# Altium schematic sheet Sheet1.SchDoc
size B; SheetNumber: 1; SheetTotal: 1
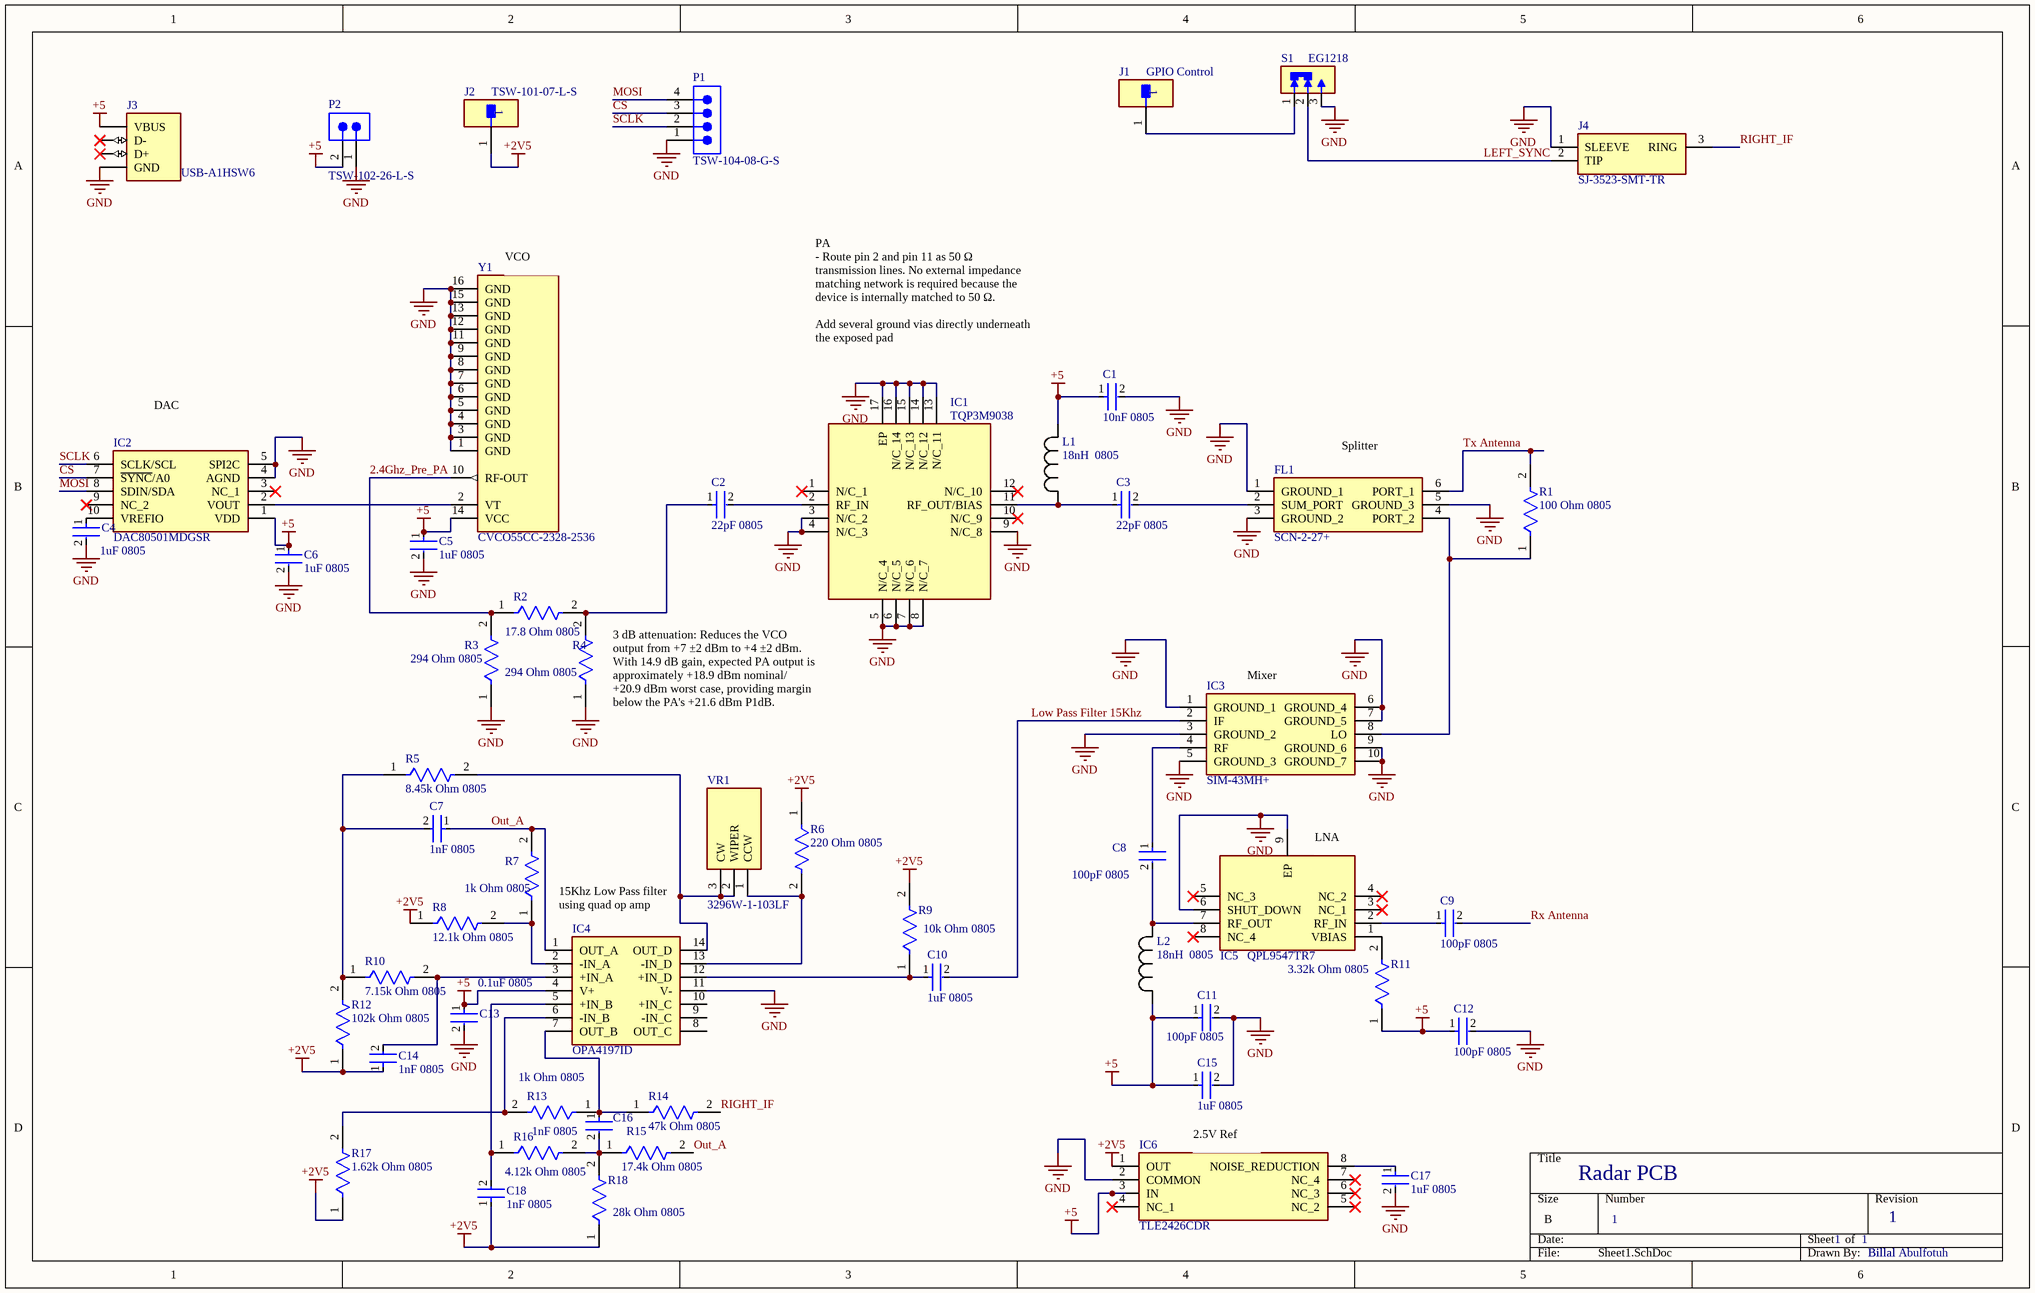
[diagram p0: Sheet1.SchDoc]

## Parts
C1  10nF 0805  [FP-C0805C103K8RACAUTO-MFG]
C2  22pF 0805  [FP-C0805C103K8RACAUTO-MFG]
C3  22pF 0805  [FP-C0805C103K8RACAUTO-MFG]
C4  1uF 0805  [FP-C0805C103K8RACAUTO-MFG]
C5  1uF 0805  [FP-C0805C103K8RACAUTO-MFG]
C6  1uF 0805  [FP-C0805C103K8RACAUTO-MFG]
C7  1nF 0805  [FP-C0805C103K8RACAUTO-MFG]
C8  100pF 0805  [FP-C0805C103K8RACAUTO-MFG]
C9  100pF 0805  [FP-C0805C103K8RACAUTO-MFG]
C10  1uF 0805  [FP-C0805C103K8RACAUTO-MFG]
C11  100pF 0805  [FP-C0805C103K8RACAUTO-MFG]
C12  100pF 0805  [FP-C0805C103K8RACAUTO-MFG]
C13  0.1uF 0805  [FP-C0805C103K8RACAUTO-MFG]
C14  1nF 0805  [FP-C0805C103K8RACAUTO-MFG]
C15  1uF 0805  [FP-C0805C103K8RACAUTO-MFG]
C16  1nF 0805  [FP-C0805C103K8RACAUTO-MFG]
C17  1uF 0805  [FP-C0805C103K8RACAUTO-MFG]
C18  1nF 0805  [FP-C0805C103K8RACAUTO-MFG]
FL1  SCN-2-27+  [SCN227]
IC1  TQP3M9038  [QFN50P300X300X90-17N-D]
IC2  DAC80501MDGSR  [SOP50P490X110-10N]
IC3  SIM-43MH+  [SIM43MH]
IC4  OPA4197ID  [SOIC127P600X175-14N]
IC5  QPL9547TR7  [SON50P200X200X95-9N-D]
IC6  TLE2426CDR  [SOIC127P600X175-8N]
J1  GPIO Control  [FP-TSW-101-07-L-S-MFG]
J2  TSW-101-07-L-S  [FP-TSW-101-07-L-S-MFG]
J3  USB-A1HSW6  [OST_USB-A1HSW6]
J4  SJ-3523-SMT-TR  [SJ3523SMTTR]
L1  18nH  0805  [IND_BOURNS_CW201212]
L2  18nH  0805  [IND_BOURNS_CW201212]
P1  TSW-104-08-G-S  [SMTC-TSW-104-08-X-S]
P2  TSW-102-26-L-S  [SMTC-TSW-102-26-XX-S]
R1  100 Ohm 0805  [FP-RT0805-MFG]
R2  17.8 Ohm 0805  [FP-RT0805-MFG]
R3  294 Ohm 0805  [FP-RT0805-MFG]
R4  294 Ohm 0805  [FP-RT0805-MFG]
R5  8.45k Ohm 0805  [FP-RT0805-MFG]
R6  220 Ohm 0805  [FP-RT0805-MFG]
R7  1k Ohm 0805  [FP-RT0805-MFG]
R8  12.1k Ohm 0805  [FP-RT0805-MFG]
R9  10k Ohm 0805  [FP-RT0805-MFG]
R10  7.15k Ohm 0805  [FP-RT0805-MFG]
R11  3.32k Ohm 0805  [FP-RT0805-MFG]
R12  102k Ohm 0805  [FP-RT0805-MFG]
R13  1k Ohm 0805  [FP-RT0805-MFG]
R14  47k Ohm 0805  [FP-RT0805-MFG]
R15  17.4k Ohm 0805  [FP-RT0805-MFG]
R16  4.12k Ohm 0805  [FP-RT0805-MFG]
R17  1.62k Ohm 0805  [FP-RT0805-MFG]
R18  28k Ohm 0805  [FP-RT0805-MFG]
S1  EG1218  [SW_EG1218]
VR1  3296W-1-103LF  [3296W1503LF]
Y1  CVCO55CC-2328-2536  [XTAL_CVCO55CC-2400-2400]

## Nets
+2V5: C14.1 C18.1 IC6.1(OUT) J2.1 R6.1 R8.1 R9.2 R12.1 R17.1 R18.1
+5: C1.1 C5.1 C6.1 C11.1 C12.1 C13.1 C15.1 IC2.1(VDD) IC4.4(V+) IC6.3(IN) J3.1(VBUS) L1.1 L2.2 P2.2 R11.1 Y1.14(VCC)
GND: C1.2 C4.2 C5.2 C6.2 C11.2 C12.2 C13.2 C15.2 C17.2 FL1.1(GROUND_1) FL1.3(GROUND_2) FL1.5(GROUND_3) IC1.3(N/C_2) IC1.4(N/C_3) IC1.5(N/C_4) IC1.6(N/C_5) IC1.7(N/C_6) IC1.8(N/C_7) IC1.9(N/C_8) IC1.13(N/C_11) IC1.14(N/C_12) IC1.15(N/C_13) IC1.16(N/C_14) IC1.17(EP) IC2.4(AGND) IC2.5(SPI2C) IC3.1(GROUND_1) IC3.3(GROUND_2) IC3.5(GROUND_3) IC3.6(GROUND_4) IC3.7(GROUND_5) IC3.9(GROUND_6) IC3.10(GROUND_7) IC4.11(V-) IC5.6(SHUT_DOWN) IC5.9(EP) IC6.2(COMMON) J3.4(GND) J4.1(SLEEVE) P1.1 P2.1 R3.1 R4.1 S1.3(NO) Y1.1(GND) Y1.3(GND) Y1.4(GND) Y1.5(GND) Y1.6(GND) Y1.7(GND) Y1.8(GND) Y1.9(GND) Y1.11(GND) Y1.12(GND) Y1.13(GND) Y1.15(GND) Y1.16(GND)
2.4Ghz_Pre_PA: R2.1 R3.2 Y1.10(RF-OUT)
CS: IC2.7(~{SYNC}/A0) P1.3
LEFT_SYNC: J4.2(TIP) S1.2(COM)
Low Pass Filter 15Khz: C10.2 IC3.2(IF)
MOSI: IC2.8(SDIN/SDA) P1.4
Out_A: C7.1 IC4.1(OUT_A) R7.2 R15.2
RIGHT_IF: J4.3(RING) R14.2
Rx Antenna: C9.2
SCLK: IC2.6(SCLK/SCL) P1.2
Tx Antenna: FL1.6(PORT_1) R1.2
NetC2_1: C2.1 R2.2 R4.2
NetC2_2: C2.2 IC1.2(RF_IN)
NetC3_1: C3.1 IC1.11(RF_OUT/BIAS) L1.2
NetC3_2: C3.2 FL1.2(SUM_PORT)
NetC4_1: C4.1 IC2.10(VREFIO)
NetC7_2: C7.2 R5.1 R10.1 R12.2
NetC8_1: C8.1 IC3.4(RF)
NetC8_2: C8.2 IC5.7(RF_OUT) L2.1
NetC9_1: C9.1 IC5.2(RF_IN)
NetC10_1: C10.1 IC4.12(+IN_D) R9.1
NetC14_2: C14.2 IC4.3(+IN_A) R10.2
NetC16_1: C16.1 IC4.7(OUT_B) R13.1 R14.1
NetC16_2: C16.2 R15.1 R16.2 R18.2
NetC17_1: C17.1 IC6.8(NOISE_REDUCTION)
NetC18_2: C18.2 IC4.5(+IN_B) R16.1
NetFL1_4: FL1.4(PORT_2) IC3.8(LO) R1.1
NetIC2_2: IC2.2(VOUT) Y1.2(VT)
NetIC4_2: IC4.2(-IN_A) R7.1 R8.2
NetIC4_6: IC4.6(-IN_B) R13.2 R17.2
NetIC4_13: IC4.13(-IN_D) R6.2 VR1.1(CCW)
NetIC4_14: IC4.14(OUT_D) R5.2 VR1.2(WIPER) VR1.3(CW)
NetIC5_1: IC5.1(VBIAS) R11.2
NetJ1_1: J1.1 S1.1(NC)

Not connected (* = marked no-connect by the designer): IC1 1(N/C_1)* 10(N/C_9)* 12(N/C_10)*; IC2 3(NC_1)* 9(NC_2)*; IC4 8(OUT_C) 9(-IN_C) 10(+IN_C); IC5 3(NC_1)* 4(NC_2)* 5(NC_3)* 8(NC_4)*; IC6 4(NC_1)* 5(NC_2)* 6(NC_3)* 7(NC_4)*; J3 2(D-)* 3(D+)*

## Notes on the sheet
- (near Y1) VCO
- PA
  - Route pin 2 and pin 11 as 50 Ω transmission lines. No external impedance matching network is required because the device is internally matched to 50 Ω.
  Add several ground vias directly underneath the exposed pad
- (near IC2) DAC
- (near FL1) Splitter
- 3 dB attenuation: Reduces the VCO output from +7 ±2 dBm to +4 ±2 dBm. With 14.9 dB gain, expected PA output is approximately +18.9 dBm nominal/ +20.9 dBm worst case, providing margin below the PA's +21.6 dBm P1dB.
- (near IC3) Mixer
- (near IC5) LNA
- 15Khz Low Pass filter using quad op amp
- (near IC6) 2.5V Ref
- Radar PCB
- 1
- Billal Abulfotuh
- Billal

## Library data of the parts
C1 = CMP-00212-126448506-1: C0805C103K8RACAUTO Cap, 0.01UF, 10V, Mlcc, 0805 Rohs Compliant: Yes; Material: Ceramic; Dielectric: X7R; Tolerance: 10%; Height: 880µm; NexarPartId: 126448506; Voltage Rating: 10V; Voltage Rating (DC): 10V; Min Operating Temperature: -55°C; Capacitance: 10nF; Max Operating Temperature: 125°C; Case/Package: 0805; RoHS: Compliant
C2-C18 = CMP-00212-126448506-1: C0805C103K8RACAUTO Cap, 0.01UF, 10V, Mlcc, 0805 Rohs Compliant: Yes; Material: Ceramic; Capacitance: 10nF; Dielectric: X7R; Tolerance: 10%; Height: 880µm; NexarPartId: 126448506; Voltage Rating: 10V; Voltage Rating (DC): 10V; Min Operating Temperature: -55°C; Max Operating Temperature: 125°C; Case/Package: 0805; RoHS: Compliant
FL1 = SCN-2-27+: Filter; Manufacturer_Name: Mini-Circuits; Datasheet Link: https://www.minicircuits.com/WebStore/dashboardPdf?model=SCN-2-27%2B; Height: 1.068mm; Manufacturer_Part_Number: SCN-2-27+; Mouser Part Number: 139-SCN-2-27; Mouser Price/Stock: https://www.mouser.co.uk/ProductDetail/Mini-Circuits/SCN-2-27%2b?qs=xZ%2FP%252Ba9zWqZ9BqpGqNwa3Q%3D%3D
IC1 = TQP3M9038: Integrated Circuit; Manufacturer_Name: Qorvo; Datasheet Link: http://www.qorvo.com/products/d/da005557; Height: 0.9mm; Manufacturer_Part_Number: TQP3M9038; Mouser Part Number: 772-TQP3M9038; Mouser Price/Stock: https://www.mouser.co.uk/ProductDetail/Qorvo/TQP3M9038?qs=ZyJ8JrQCoIZ8y9AEz%2F0DcQ%3D%3D
IC2 = DAC80501MDGSR: Integrated Circuit; Manufacturer_Name: Texas Instruments; Datasheet Link: https://www.ti.com/lit/gpn/DAC80501; Height: 1.1mm; Manufacturer_Part_Number: DAC80501MDGSR; Mouser Part Number: 595-DAC80501MDGSR; Mouser Price/Stock: https://www.mouser.co.uk/ProductDetail/Texas-Instruments/DAC80501MDGSR?qs=%252B6g0mu59x7JZMs1JuGefUg%3D%3D; Arrow Part Number: DAC80501MDGSR; Arrow Price/Stock: https://www.arrow.com/en/products/dac80501mdgsr/texas-instruments.html?utm_currency=USD&region=nac
IC3 = SIM-43MH+: Integrated Circuit; Manufacturer_Name: Mini-Circuits; Datasheet Link: https://www.minicircuits.com/pdfs/SIM-43MH+.pdf; Height: 2.2098mm; Manufacturer_Part_Number: SIM-43MH+; Mouser Part Number: 139-SIM-43MH; Mouser Price/Stock: https://www.mouser.co.uk/ProductDetail/Mini-Circuits/SIM-43MH%2b?qs=xZ%2FP%252Ba9zWqY1tFzO9OHPtQ%3D%3D
IC4 = OPA4197ID: Integrated Circuit; Manufacturer_Name: Texas Instruments; Datasheet Link: http://www.ti.com/lit/gpn/OPA4197; Height: 1.75mm; Manufacturer_Part_Number: OPA4197ID; Mouser Part Number: 595-OPA4197ID; Mouser Price/Stock: https://www.mouser.co.uk/ProductDetail/Texas-Instruments/OPA4197ID?qs=LuYMPh7GGMRrQsevs5FGag%3D%3D; Arrow Part Number: OPA4197ID; Arrow Price/Stock: https://www.arrow.com/en/products/opa4197id/texas-instruments?utm_currency=USD&region=nac
IC5 = QPL9547TR7: Integrated Circuit; Manufacturer_Name: Qorvo; Datasheet Link: https://www.qorvo.com/products/d/da007268; Height: 0.95mm; Manufacturer_Part_Number: QPL9547TR7; Mouser Part Number: 772-QPL9547TR7; Mouser Price/Stock: https://www.mouser.co.uk/ProductDetail/Qorvo/QPL9547TR7?qs=7MVldsJ5UaxZMCnAEuCHXA%3D%3D
IC6 = TLE2426CDR: Integrated Circuit; Manufacturer_Name: Texas Instruments; Datasheet Link: http://www.ti.com/lit/gpn/TLE2426; Height: 1.75mm; Manufacturer_Part_Number: TLE2426CDR; Mouser Part Number: 595-TLE2426CDR; Mouser Price/Stock: https://www.mouser.co.uk/ProductDetail/Texas-Instruments/TLE2426CDR?qs=JbBXx2IvYcd3mBRQbzOwQw%3D%3D; Arrow Part Number: TLE2426CDR; Arrow Price/Stock: https://www.arrow.com/en/products/tle2426cdr/texas-instruments.html?utm_currency=USD&region=nac
J1 J2 = CMP-02766-001775-1: CONN HEADER VERT 1POS; Gender: Male; Number of Contacts: 1; Max Current Rating: 7.6A; Max Voltage Rating (AC): 550V; RoHS Compliant: Yes; Contact Finish - Mating: GOLD; Length: 2.54mm; Series: TSW; Insulation Material: PBT; Reach SVHC Compliant: Yes; Radiation Hardening: No; Contact Plating: Gold; Termination: Solder; Contact Type: Male Pin; Orientation: Straight; Number of Rows: 1; Depth: 2.54mm; Housing Material: Polyester; Lead Free: Lead Free; Fastening Type: Pull; Flammability Rating: UL94 V-0; Mount: Through Hole; Housing Color: Black; Contact Shape: Square; Min Operating Temperature: -55°C; Connector Type: Header; Contact Mating Length: 0.23inch; Width: 2.54mm; Packaging: Bulk; Contact Material: Bronze; Max Operating Temperature: 125°C; Number of Positions: 1; Color: Black; Insulation Color: Black
J3 = USB-A1HSW6: MF: {'manufacturer': u'On Shore Technology Inc.'}; Package: None; Price: None; Value: *; MP: USB-A1HSW6; Availability: Unavailable
J4 = SJ-3523-SMT-TR: Connector; Manufacturer_Name: Same Sky; Datasheet Link: https://www.sameskydevices.com/product/resource/sj-352x-smt.pdf; Height: 5.2mm; Manufacturer_Part_Number: SJ-3523-SMT-TR; Mouser Part Number: 490-SJ-3523-SMT-TR; Mouser Price/Stock: https://www.mouser.co.uk/ProductDetail/CUI-Devices/SJ-3523-SMT-TR?qs=WyjlAZoYn51zOHzJ3r4ZRA%3D%3D; Arrow Part Number: SJ-3523-SMT-TR; Arrow Price/Stock: https://www.arrow.com/en/products/sj-3523-smt-tr_4/cui-devices.html?utm_currency=USD&region=nac
L1 L2 = CW201212-18NJ: No Description Available; Manufacturer_Name: Bourns Electronics; Copyright: Copyright (C) 2026 Ultra Librarian. All rights reserved.; Manufacturer_Part_Number: CW201212-18NJ
P1 = CMP-1024-00357-1: 0.025" SQ Post Header, Through-hole, Vertical, -55 to 125 degC, 2.54 mm Pitch, 4-Pin, Male, RoHS; Manufacturer: Samtec; Pitch: 2.54 mm; RoHS: True; ComponentLink3URL: http://www.samtec.com/documents/webfiles/cpdf/TSW-XXX-XX-XXX-X-XX-XXX-MKT.pdf; Mounting Technology: Through-hole; ComponentLink2URL: http://www.samtec.com/documents/webfiles/pdf/TSW_TH.PDF; ComponentLink1URL: http://www.samtec.com; ComponentLink3Description: Package Specification; PackageVersion: DM, 8/1988; ComponentLink2Description: Datasheet; PackageReference: TSW-104-08-X-S; PackageDescription: .025[0.64] SQ. Post Terminal Strip Assembly; PartNumber: TSW-104-08-G-S; ComponentLink1Description: Manufacturer URL; Temperature Range: -55 to 125 degC; DatasheetVersion: F-214; Orientation: Vertical
P2 = CMP-1024-00330-1: 0.025" SQ Post Header, Through-hole, Vertical, -55 to 125 degC, 2.54 mm Pitch, 2-Pin, Male, RoHS; Manufacturer: Samtec; Pitch: 2.54 mm; DatasheetVersion: F-214; PackageReference: TSW-102-26-XX-S; ComponentLink3Description: Package Specification; PackageDescription: .025[0.64] SQ. Post Terminal Strip Assembly; PackageVersion: DM, 8/1988; ComponentLink1Description: Manufacturer URL; ComponentLink2URL: http://www.samtec.com/documents/webfiles/pdf/TSW_TH.PDF; ComponentLink3URL: http://www.samtec.com/documents/webfiles/cpdf/TSW-XXX-XX-XXX-X-XX-XXX-MKT.pdf; ComponentLink2Description: Datasheet; Temperature Range: -55 to 125 degC; Mounting Technology: Through-hole; ComponentLink1URL: http://www.samtec.com; RoHS: True; PartNumber: TSW-102-26-L-S; Orientation: Vertical
R1-R18 = CMP-03412-013473-1: RES SMD 75 OHM 0.5% 1/8W 0805; Manufacturer Part Number: RT0805DRD0775RL; Manufacturer: Yageo; Power Rating: 0.125W; Tolerance: 0.01; Resistance: 75Ω; Temperature Coefficient: 25 ppm/°C; Value: 75Ω; Voltage Rating: 150V; Series: RT; Composition: Thin Film; Temperature: -55°C to +155°C; Footprint Url: http://www.yageo.com/exep/pages/download/literatures/PYu-R_Mount_10.pdf; ComponentLink2URL: http://www.yageo.com/documents/recent/PYu-RT_1-to-0.01_RoHS_L_9.pdf; Device Class L1: Passive Components; Height: 0.6mm; Automotive: No; RoHS: TRUE; Digikey Description: RES SMD 75 OHM 0.5% 1/8W 0805; Device Class L3: Chip SMD Resistors; Lead Free: Yes; ComponentLink2Description: Datasheet; Ipc Land Pattern Name: RESC200125X50; Package: RT0805; Category: Res; Temperature Range Low: -55°C; Temperature Range High: +155°C; Octopart: https://octopart.com/rt0805drd0775rl-yageo-1390155; Device Class L2: Resistors
S1 = EG1218: Slide Switch, EG Series, SPDT, Non-Shorting, ON-ON, 200mA DC, 30VDC, PC Pin | E-Switch EG1218; SnapEDA_Link: https://www.snapeda.com/parts/EG1218/E-Switch/view-part/?ref=snap; Package: None; Value: *; MF: E-Switch; MP: EG1218; Check_prices: https://www.snapeda.com/parts/EG1218/E-Switch/view-part/?ref=eda
VR1 = 3296W-1-103LF: Variable Resistor; Manufacturer_Name: Bourns; Datasheet Link: https://www.bourns.com/pdfs/3296.pdf; Height: 10.28mm; Manufacturer_Part_Number: 3296W-1-103LF; Mouser Part Number: 652-3296W-1-103LF; Mouser Price/Stock: https://www.mouser.co.uk/ProductDetail/Bourns/3296W-1-103LF?qs=CL3xLxiry19Id6AEaxYcng%3D%3D; Arrow Part Number: 3296W-1-103LF; Arrow Price/Stock: https://www.arrow.com/en/products/3296w-1-103lf/bourns.html?utm_currency=USD&region=europe
Y1 = CVCO55CC-2400-2400: 2400MHz Center Frequency 0.5 V ~ 4.5 V Voltage Controlled Oscillator 7 Â±2 dBm -25 2nd Harmonic Typ (dBc); MF: Crystek Corporation; Check_prices: https://www.snapeda.com/parts/CVCO55CC-2400-2400/Crystek+Corporation/view-part/?ref=eda; SnapEDA_Link: https://www.snapeda.com/parts/CVCO55CC-2400-2400/Crystek+Corporation/view-part/?ref=snap; Value: *; Digi-Key_Part_Number: 744-1546-ND; MP: CVCO55CC-2400-2400; Purchase-URL: https://pricing.snapeda.com/search/part/CVCO55CC-2400-2400/?ref=eda; Package: QFN-16 Crystek Corporation